# Altium project PCB_ESP.PrjPCB
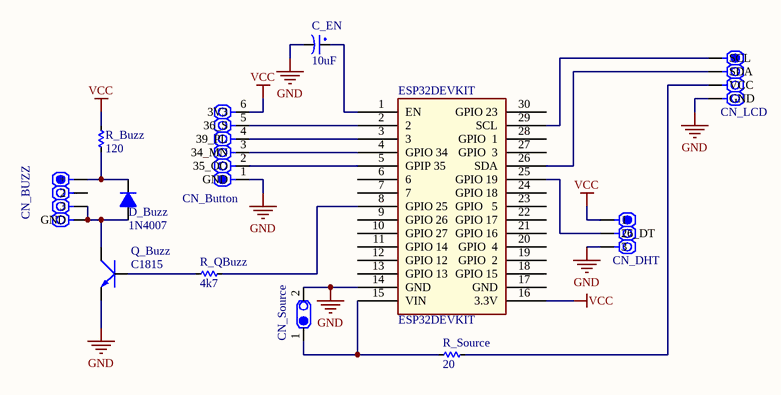
[diagram p0: ESP.SchDoc]
1 sheet, 12 parts. Net scope: global (net labels, ports and power ports of the same name join across sheets).
Board file: ESP.PcbDoc

## Sheet ESP.SchDoc
size A

### Parts
C_EN  10uF  [CP1/2]
CN_Button  IO  [CON.HD1X6H]  (value not drawn)
CN_BUZZ  IO  [CON.HDR1X4L]  (value not drawn)
CN_DHT  IO  [CON.HDR1X3]  (value not drawn)
CN_LCD  IO  [CON.HDR1X4L]  (value not drawn)
CN_Source  IO  [CON.HDR1X2A]  (value not drawn)
D_Buzz  1N4007  [D1A]
ESP32DEVKIT  ESP32DEVKIT  [ESP32devKitV1]
Q_Buzz  C1815  [QTO-92]
R_Buzz  120  [RES-1/4W]
R_QBuzz  4k7  [RES-1/4W]
R_Source  20  [RES-1/4W]

### Nets
GND: C_EN.2 CN_Button.1(GND) CN_DHT.3 CN_LCD.4(GND) CN_Source.2 ESP32DEVKIT.14(GND) Q_Buzz.1(E)
VCC: CN_Button.6(3V3) CN_DHT.1 ESP32DEVKIT.16(3.3V) R_Buzz.1
NetC_EN_1: C_EN.1 ESP32DEVKIT.1(EN)
NetCN_Button_2: CN_Button.2(35_OO) ESP32DEVKIT.5(GPIP_35)
NetCN_Button_3: CN_Button.3(34_MN) ESP32DEVKIT.4(GPIO_34)
NetCN_Button_4: CN_Button.4(39_PL) ESP32DEVKIT.3
NetCN_Button_5: CN_Button.5(36_S) ESP32DEVKIT.2
NetCN_BUZZ_1: CN_BUZZ.1(+) D_Buzz.2(K) R_Buzz.2
NetCN_BUZZ_3: CN_BUZZ.3 CN_BUZZ.4(GND) D_Buzz.1(A) Q_Buzz.2(C)
NetCN_DHT_2: CN_DHT.2(26_DT) ESP32DEVKIT.25(GPIO_19)
NetCN_LCD_1: CN_LCD.1(SCL) ESP32DEVKIT.29(SCL)
NetCN_LCD_2: CN_LCD.2(SDA) ESP32DEVKIT.26(SDA)
NetCN_LCD_3: CN_LCD.3(VCC) R_Source.1
NetCN_Source_1: CN_Source.1 ESP32DEVKIT.15(VIN) R_Source.2
NetESP32DEVKIT_8: ESP32DEVKIT.8(GPIO_25) R_QBuzz.1
NetQ_Buzz_3: Q_Buzz.3(B) R_QBuzz.2

Not connected (* = marked no-connect by the designer): CN_BUZZ 2; ESP32DEVKIT 6 7 9(GPIO_26) 10(GPIO_27) 11(GPIO_14) 12(GPIO_12) 13(GPIO_13) 17(GND) 18(GPIO_15) 19(GPIO__2) 20(GPIO__4) 21(GPIO_16) 22(GPIO_17) 23(GPIO___5) 24(GPIO_18) 27(GPIO__3) 28(GPIO__1) 30(GPIO_23)

### Library data of the parts
C_EN = CP1: Cap P  0,1uF < 22uF , 16 - 50V; Value: 10uF/50V; Description 1: 10 => 220uF/6,3V/10V - 10uF => 100uF/16V; Description 2: 0,1uF => 33uF/50V - 10uF => 22uF/63V; Description 3: 0,47uF => 10uF/100V
CN_Button = CON.HDR1x6: Header 1x5; Publisher: Hoang Nguyen; ComponentLink1Description: Digikey Part link; ComponentLink2Description: Open DataSheet; ComponentLink2URL: H:\LIBRARY\LIBRARY.Datasheet\
CN_BUZZ CN_LCD = CON.HDR1x4: Header 1x4; Publisher: NKIM; ComponentLink1Description: Digikey Part link; ComponentLink2Description: Open DataSheet; ComponentLink2URL: H:\LIBRARY\LIBRARY.Datasheet\
CN_DHT = CON.HDR1x3: Header 1x3; Publisher: NKIM; ComponentLink1Description: Digikey Part link; ComponentLink2Description: Open DataSheet; ComponentLink2URL: H:\LIBRARY\LIBRARY.Datasheet\
CN_Source = CON.HDR1x2: Header 1x2; Publisher: Hoang Nguyen; ComponentLink1Description: Digikey Part link; ComponentLink2Description: Open DataSheet; ComponentLink2URL: H:\LIBRARY\LIBRARY.Datasheet\
D_Buzz = D1A: Diode 1A; Value: 1N4007
Q_Buzz = C1815: NPN 600mW, ECB; Value: C1815
R_Buzz R_QBuzz R_Source = Res: Manufacturer: Generic Components; Class: Passive; SubClass: R; Published: 08/06/2000; Publisher: Altium Hobart Technology Centre